# Altium schematic sheet RF DAC.SchDoc
size B
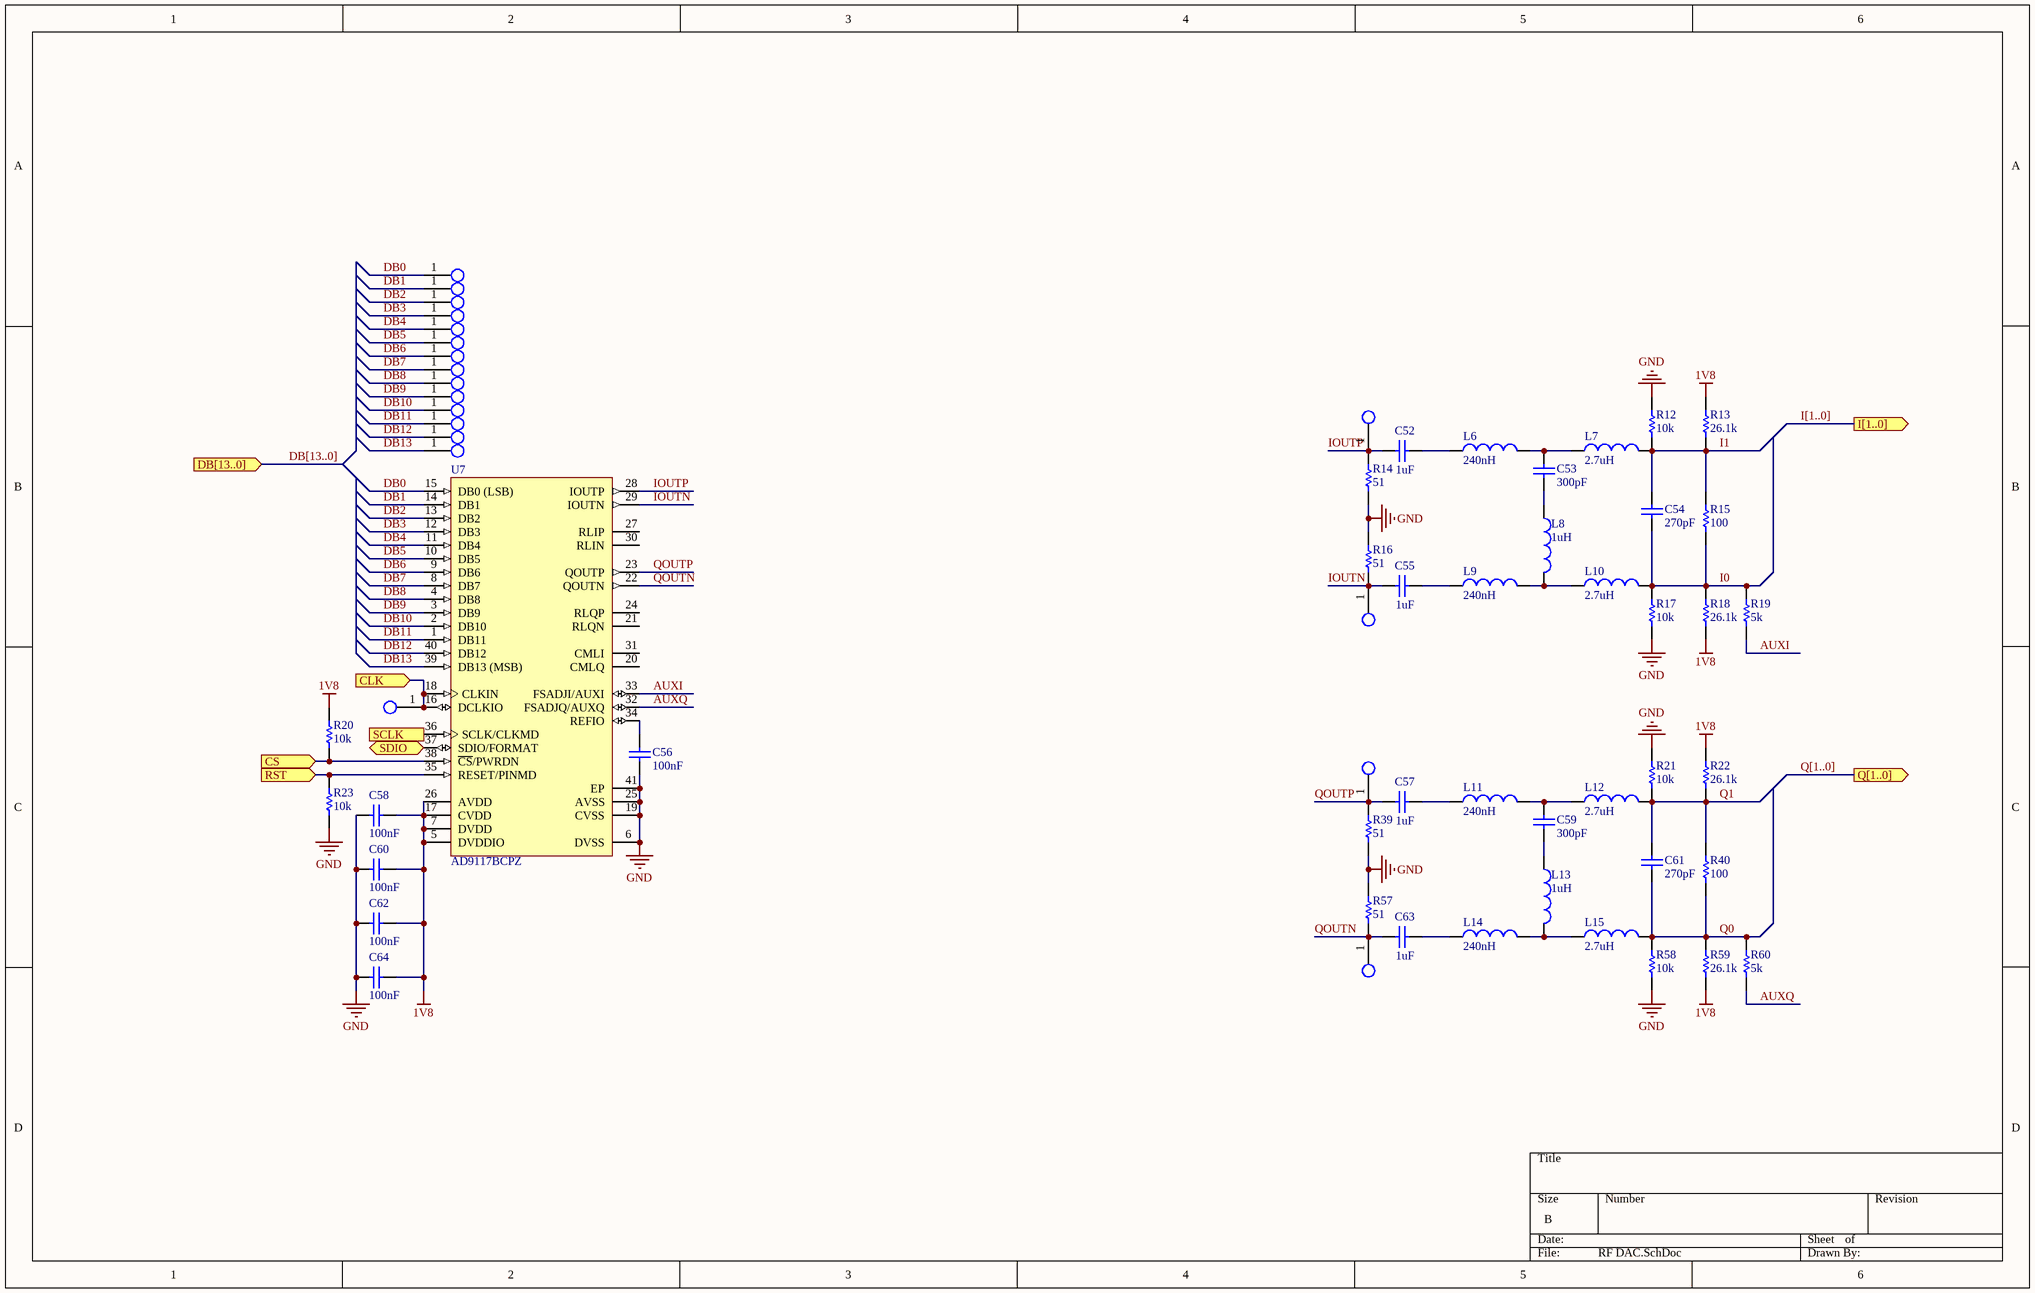
[diagram p0: RF DAC.SchDoc]

## Parts
C52  value 1uF  [1608[0603]]  (hidden comment: Cap)
C53  value 300pF  [0402-A]  (hidden comment: Cap)
C54  value 270pF  [0402-A]  (hidden comment: Cap)
C55  value 1uF  [1608[0603]]  (hidden comment: Cap)
C56  value 100nF  [0402-A]  (hidden comment: Cap)
C57  value 1uF  [1608[0603]]  (hidden comment: Cap)
C58  value 100nF  [0402-A]  (hidden comment: Cap)
C59  value 300pF  [0402-A]  (hidden comment: Cap)
C60  value 100nF  [0402-A]  (hidden comment: Cap)
C61  value 270pF  [0402-A]  (hidden comment: Cap)
C62  value 100nF  [0402-A]  (hidden comment: Cap)
C63  value 1uF  [1608[0603]]  (hidden comment: Cap)
C64  value 100nF  [0402-A]  (hidden comment: Cap)
CLK  5029  [EXPOSED PAD 0.02X0.02]  (value not drawn)
DB0  5029  [EXPOSED PAD 0.02X0.02]  (value not drawn)
DB1  5029  [EXPOSED PAD 0.02X0.02]  (value not drawn)
DB2  5029  [EXPOSED PAD 0.02X0.02]  (value not drawn)
DB3  5029  [EXPOSED PAD 0.02X0.02]  (value not drawn)
DB4  5029  [EXPOSED PAD 0.02X0.02]  (value not drawn)
DB5  5029  [EXPOSED PAD 0.02X0.02]  (value not drawn)
DB6  5029  [EXPOSED PAD 0.02X0.02]  (value not drawn)
DB7  5029  [EXPOSED PAD 0.02X0.02]  (value not drawn)
DB8  5029  [EXPOSED PAD 0.02X0.02]  (value not drawn)
DB9  5029  [EXPOSED PAD 0.02X0.02]  (value not drawn)
DB10  5029  [EXPOSED PAD 0.02X0.02]  (value not drawn)
DB11  5029  [EXPOSED PAD 0.02X0.02]  (value not drawn)
DB12  5029  [EXPOSED PAD 0.02X0.02]  (value not drawn)
DB13  5029  [EXPOSED PAD 0.02X0.02]  (value not drawn)
J22  5029  [EXPOSED PAD 0.02X0.02]  (value not drawn)
J25  5029  [EXPOSED PAD 0.02X0.02]  (value not drawn)
J26  5029  [EXPOSED PAD 0.02X0.02]  (value not drawn)
J29  5029  [EXPOSED PAD 0.02X0.02]  (value not drawn)
L6  value 240nH  [0402-A]  (hidden comment: Inductor)
L7  value 2.7uH  [1608[0603]]  (hidden comment: Inductor)
L8  value 1uH  [1608[0603]]  (hidden comment: Inductor)
L9  value 240nH  [0402-A]  (hidden comment: Inductor)
L10  value 2.7uH  [1608[0603]]  (hidden comment: Inductor)
L11  value 240nH  [0402-A]  (hidden comment: Inductor)
L12  value 2.7uH  [1608[0603]]  (hidden comment: Inductor)
L13  value 1uH  [1608[0603]]  (hidden comment: Inductor)
L14  value 240nH  [0402-A]  (hidden comment: Inductor)
L15  value 2.7uH  [1608[0603]]  (hidden comment: Inductor)
R12  value 10k  [0402-A]  (hidden comment: Res1)
R13  value 26.1k  [0402-A]  (hidden comment: Res1)
R14  value 51  [0402-A]  (hidden comment: Res1)
R15  value 100  [0402-A]  (hidden comment: Res1)
R16  value 51  [0402-A]  (hidden comment: Res1)
R17  value 10k  [0402-A]  (hidden comment: Res1)
R18  value 26.1k  [0402-A]  (hidden comment: Res1)
R19  value 5k  [0402-A]  (hidden comment: Res1)
R20  value 10k  [0402-A]  (hidden comment: Res1)
R21  value 10k  [0402-A]  (hidden comment: Res1)
R22  value 26.1k  [0402-A]  (hidden comment: Res1)
R23  value 10k  [0402-A]  (hidden comment: Res1)
R39  value 51  [0402-A]  (hidden comment: Res1)
R40  value 100  [0402-A]  (hidden comment: Res1)
R57  value 51  [0402-A]  (hidden comment: Res1)
R58  value 10k  [0402-A]  (hidden comment: Res1)
R59  value 26.1k  [0402-A]  (hidden comment: Res1)
R60  value 5k  [0402-A]  (hidden comment: Res1)
U7  AD9117BCPZ  [CP-40-1_N]

## Ports
CLK (in), CS (in), DB[13..0] (in), I[1..0] (out), Q[1..0] (out), RST (in), SCLK (in), SDIO (bidir)

## Nets
1V8: C58.2 C60.2 C62.2 C64.2 R13.2 R18.1 R20.2 R22.2 R59.1 U7.5(DVDDIO) U7.7(DVDD) U7.17(CVDD) U7.26(AVDD)
GND: C56.1 C58.1 C60.1 C62.1 C64.1 R12.2 R14.1 R16.2 R17.1 R21.2 R23.1 R39.1 R57.2 R58.1 U7.6(DVSS) U7.19(CVSS) U7.25(AVSS) U7.41(EP)
AUXI: R19.1 U7.33(FSADJI/AUXI)
AUXQ: R60.1 U7.32(FSADJQ/AUXQ)
CLK: CLK.1 U7.16(DCLKIO) U7.18(CLKIN) ; port CLK
CS: R20.1 U7.38(~{CS}/PWRDN) ; port CS
DB0: DB0.1 U7.15(DB0_(LSB))
DB1: DB1.1 U7.14(DB1)
DB2: DB2.1 U7.13(DB2)
DB3: DB3.1 U7.12(DB3)
DB4: DB4.1 U7.11(DB4)
DB5: DB5.1 U7.10(DB5)
DB6: DB6.1 U7.9(DB6)
DB7: DB7.1 U7.8(DB7)
DB8: DB8.1 U7.4(DB8)
DB9: DB9.1 U7.3(DB9)
DB10: DB10.1 U7.2(DB10)
DB11: DB11.1 U7.1(DB11)
DB12: DB12.1 U7.40(DB12)
DB13: DB13.1 U7.39(DB13_(MSB))
I0: C54.2 L10.2 R15.1 R17.2 R18.2 R19.2
I1: C54.1 L7.2 R12.1 R13.1 R15.2
IOUTN: C55.2 J25.1 R16.1 U7.29(IOUTN)
IOUTP: C52.2 J22.1 R14.2 U7.28(IOUTP)
Q0: C61.2 L15.2 R40.1 R58.2 R59.2 R60.2
Q1: C61.1 L12.2 R21.1 R22.1 R40.2
QOUTN: C63.2 J29.1 R57.1 U7.22(QOUTN)
QOUTP: C57.2 J26.1 R39.2 U7.23(QOUTP)
RST: R23.2 U7.35(RESET/PINMD) ; port RST
SCLK: U7.36(SCLK/CLKMD) ; port SCLK
SDIO: U7.37(SDIO/FORMAT) ; port SDIO
NetC52_1: C52.1 L6.1
NetC53_1: C53.1 L6.2 L7.1
NetC53_2: C53.2 L8.1
NetC55_1: C55.1 L9.1
NetC56_2: C56.2 U7.34(REFIO)
NetC57_1: C57.1 L11.1
NetC59_1: C59.1 L11.2 L12.1
NetC59_2: C59.2 L13.1
NetC63_1: C63.1 L14.1
NetL8_2: L8.2 L9.2 L10.1
NetL13_2: L13.2 L14.2 L15.1

Not connected (* = marked no-connect by the designer): U7 20(CMLQ) 21(RLQN) 24(RLQP) 27(RLIP) 30(RLIN) 31(CMLI)

## Buses and harness runs
bus DB[13..0] = port DB[13..0]
bus I[1..0] = port I[1..0]
bus Q[1..0] = port Q[1..0]

## Library data of the parts
C52-C64 = Cap: Capacitor; Published: 8-Jun-2000; LatestRevisionDate: 17-Jul-2002; LatestRevisionNote: Re-released for DXP Platform.; PackageReference: RAD-0.3; Publisher: Altium Limited; PackageDescription: Radial Cap, Thru-Hole; 2 Leads; 0.3 in Pin Spacing
L6-L15 = Inductor: Code_IEC: 1005; Published: 8-Jun-2000; LatestRevisionDate: 29-May-2009; LatestRevisionNote: IPC-7351 Footprint Added.; PackageReference: 0402-A; Publisher: Altium Limited; PackageDescription: Chip Inductor; Code_JEITA: 0402
R12-R23 R39 R40 R57-R60 = Res1: Resistor; Published: 8-Jun-2000; LatestRevisionDate: 17-Jul-2002; LatestRevisionNote: Re-released for DXP Platform.; PackageReference: AXIAL-0.3; Publisher: Altium Limited; PackageDescription: Axial Device, Thru-Hole; 2 Leads; 0.3 in Pin Spacing
U7 = CMP-0318-00565-2: Dual 14-Bit Low Power TxDAC Digital-to-Analog Converter, 0 to +70 degC, CP-40-1, Pb-Free, Tray; Manufacturer: Analog Devices; Generic Part Number: AD9117; Max V+: 3.3V; Single Supply: Yes; # DAC Outputs: 2; Resolution (Bits): 14; ComponentLink4Description: Product URL; ComponentLink2URL: http://www.analog.com/static/imported-files/data_sheets/AD9114_9115_9116_9117.pdf; Packing: Tray; PackageDescription: 40-Pin Lead Frame Chip Scale Package [LFCSP_VQ] Very Thin Quad; PackageVersion: Oct-2006; ComponentLink1URL: http://www.analog.com/en/index.html; Mounting Technology: Surface Mount; ComponentLink5URL: http://www.analog.com/en/digital-to-analog-converters/da-converters/ad9117/products/product.html#prod_cross_sell; ComponentLink3Description: Package Specification; PartNumber: AD9117BCPZ; PackageReference: CP-40-1; ComponentLink1Description: Manufacturer URL; ComponentLink4URL: http://www.analog.com/en/digital-to-analog-converters/da-converters/ad9117/products/product.html; ComponentLink3URL: http://www.analog.com/static/imported-files/packages/PKG_PDF/LFCSP(CP)/CP_40_1.pdf; ComponentLink2Description: Datasheet; ComponentLink5Description: Reference Design URL; Code_JEDEC: MO-220-VJJD-2; RoHS: Y; RevisionNote: Component URL fixed; DatasheetVersion: Rev.B